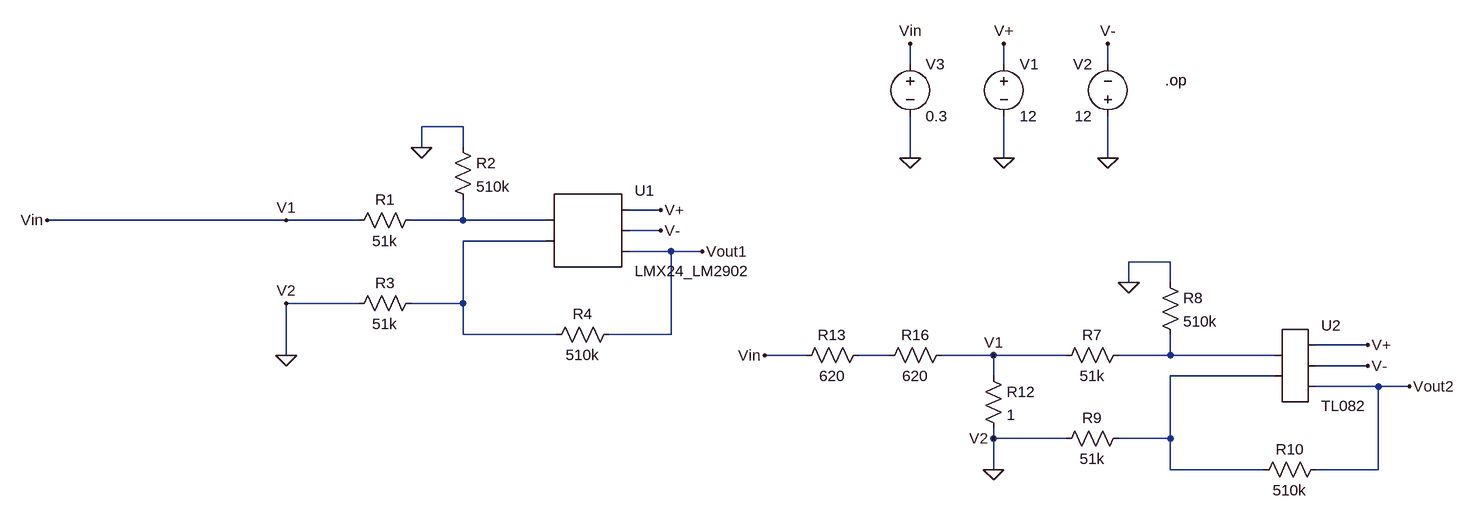
[diagram p0: schematic relat14.asc]
relat14.asc, the LTspice schematic file:
Version 4
SHEET 1 1876 932
WIRE 976 -96 976 -128
WIRE 1120 -96 1120 -128
WIRE 1280 -96 1280 -128
WIRE 288 0 224 0
WIRE 224 32 224 0
WIRE 288 32 288 0
WIRE 976 48 976 -16
WIRE 1120 48 1120 -16
WIRE 1280 48 1280 -16
WIRE 592 128 544 128
WIRE 16 144 -352 144
WIRE 128 144 16 144
WIRE 288 144 288 112
WIRE 288 144 208 144
WIRE 416 144 288 144
WIRE 592 160 544 160
WIRE 416 176 288 176
WIRE 608 192 544 192
WIRE 656 192 608 192
WIRE 1376 208 1312 208
WIRE 1312 240 1312 208
WIRE 1376 240 1376 208
WIRE 128 272 16 272
WIRE 288 272 288 176
WIRE 288 272 208 272
WIRE 288 320 288 272
WIRE 432 320 288 320
WIRE 608 320 608 192
WIRE 608 320 512 320
WIRE 1680 336 1600 336
WIRE 16 352 16 272
WIRE 816 352 752 352
WIRE 944 352 896 352
WIRE 1104 352 1024 352
WIRE 1216 352 1104 352
WIRE 1376 352 1376 320
WIRE 1376 352 1296 352
WIRE 1536 352 1376 352
WIRE 1680 368 1600 368
WIRE 1104 384 1104 352
WIRE 1536 384 1376 384
WIRE 1696 400 1600 400
WIRE 1744 400 1696 400
WIRE 1104 480 1104 464
WIRE 1216 480 1104 480
WIRE 1376 480 1376 384
WIRE 1376 480 1296 480
WIRE 1104 528 1104 480
WIRE 1376 528 1376 480
WIRE 1520 528 1376 528
WIRE 1696 528 1696 400
WIRE 1696 528 1600 528
FLAG 224 32 0
FLAG 656 192 Vout1
FLAG 1280 48 0
FLAG 1120 48 0
FLAG 1120 -128 V+
FLAG 1280 -128 V-
FLAG 592 128 V+
FLAG 592 160 V-
FLAG 976 48 0
FLAG 976 -128 Vin
FLAG 16 144 V1
FLAG -352 144 Vin
FLAG 16 272 V2
FLAG 1312 240 0
FLAG 1744 400 Vout2
FLAG 1680 336 V+
FLAG 1680 368 V-
FLAG 1104 352 V1
FLAG 752 352 Vin
FLAG 1104 480 V2
FLAG 1104 528 0
FLAG 16 352 0
SYMBOL res 224 128 R90
WINDOW 0 0 56 VBottom 2
WINDOW 3 32 56 VTop 2
SYMATTR InstName R1
SYMATTR Value 51k
SYMBOL res 272 16 R0
SYMATTR InstName R2
SYMATTR Value 510k
SYMBOL AutoGenerated\\LMX24_LM2902 480 160 R0
SYMATTR InstName U1
SYMBOL res 224 256 R90
WINDOW 0 0 56 VBottom 2
WINDOW 3 32 56 VTop 2
SYMATTR InstName R3
SYMATTR Value 51k
SYMBOL res 416 336 R270
WINDOW 0 32 56 VTop 2
WINDOW 3 0 56 VBottom 2
SYMATTR InstName R4
SYMATTR Value 510k
SYMBOL voltage 1120 -112 R0
WINDOW 123 0 0 Left 0
WINDOW 39 0 0 Left 0
SYMATTR InstName V1
SYMATTR Value 12
SYMBOL voltage 1280 0 R180
WINDOW 0 24 96 Left 2
WINDOW 3 24 16 Left 2
WINDOW 123 0 0 Left 0
WINDOW 39 0 0 Left 0
SYMATTR InstName V2
SYMATTR Value 12
SYMBOL voltage 976 -112 R0
WINDOW 123 0 0 Left 0
WINDOW 39 0 0 Left 0
SYMATTR InstName V3
SYMATTR Value 0.3
SYMBOL res 1312 336 R90
WINDOW 0 0 56 VBottom 2
WINDOW 3 32 56 VTop 2
SYMATTR InstName R7
SYMATTR Value 51k
SYMBOL res 1360 224 R0
SYMATTR InstName R8
SYMATTR Value 510k
SYMBOL res 1312 464 R90
WINDOW 0 0 56 VBottom 2
WINDOW 3 32 56 VTop 2
SYMATTR InstName R9
SYMATTR Value 51k
SYMBOL res 1504 544 R270
WINDOW 0 32 56 VTop 2
WINDOW 3 0 56 VBottom 2
SYMATTR InstName R10
SYMATTR Value 510k
SYMBOL res 1088 368 R0
SYMATTR InstName R12
SYMATTR Value 1
SYMBOL res 912 336 R90
WINDOW 0 0 56 VBottom 2
WINDOW 3 32 56 VTop 2
SYMATTR InstName R13
SYMATTR Value 620
SYMBOL AutoGenerated\\TL082 1568 368 R0
SYMATTR InstName U2
SYMBOL res 1040 336 R90
WINDOW 0 0 56 VBottom 2
WINDOW 3 32 56 VTop 2
SYMATTR InstName R16
SYMATTR Value 620
TEXT 1368 -72 Left 2 !.op

The netlist it stands for:
* relat14.asc
R1 N001 V1 51k
R2 0 N001 510k
* U1: LMX24_LM2902 (symbol AutoGenerated\LMX24_LM2902 not available, pins judged from their places): pin1=N001 pin2=N002 pin3=V+ pin4=V- pin5=Vout1
R3 N002 0 51k
R4 N002 Vout1 510k
V1 V+ 0 12
V2 0 V- 12
V3 V1 0 0.3
R7 N004 V1 51k
R8 0 N004 510k
R9 N005 0 51k
R10 N005 Vout2 510k
R12 V1 0 1
R13 N003 V1 620
* U2: TL082 (symbol AutoGenerated\TL082 not available, pins judged from their places): pin1=N004 pin2=N005 pin3=V+ pin4=V- pin5=Vout2
R16 V1 N003 620
.op
.backanno
.end